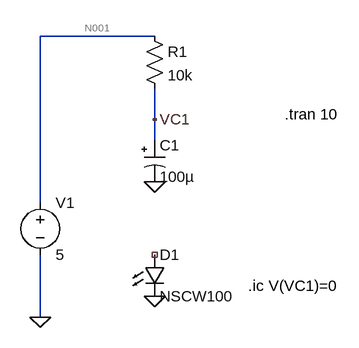
[diagram p0: schematic Project.asc]
Project.asc, the LTspice schematic file:
Version 4
SHEET 1 908 680
WIRE 64 -176 -112 -176
WIRE 64 -48 64 -96
WIRE 64 -16 64 -48
WIRE -112 80 -112 -176
WIRE -112 256 -112 160
FLAG -112 256 0
FLAG 64 -48 VC1
FLAG 64 224 0
FLAG 64 48 0
SYMBOL voltage -112 64 R0
WINDOW 123 0 0 Left 0
WINDOW 39 0 0 Left 0
SYMATTR InstName V1
SYMATTR Value 5
SYMBOL polcap 48 -16 R0
WINDOW 3 24 56 Left 2
SYMATTR InstName C1
SYMATTR Value 100µ
SYMATTR Description Capacitor
SYMATTR Type cap
SYMATTR SpiceLine V=25 Irms=250m Rser=0.6 Lser=0 mfg="Nichicon" pn="UPG1E101MPH" type="Al electrolytic"
SYMBOL res 48 -192 R0
SYMATTR InstName R1
SYMATTR Value 10k
SYMATTR SpiceLine tol=1
SYMBOL LED 48 160 R0
SYMATTR InstName D1
SYMATTR Value NSCW100
TEXT 264 -56 Left 2 !.tran 10
TEXT 208 208 Left 2 !.ic V(VC1)=0

The netlist it stands for:
* Project.asc
V1 N001 0 5
C1 VC1 0 100µ V=25 Irms=250m Rser=0.6 Lser=0 mfg="Nichicon" pn="UPG1E101MPH" type="Al electrolytic"
R1 N001 VC1 10k tol=1
D1 NC_01 0 NSCW100
.model D D
.lib standard.dio
.tran 10
.ic V(VC1)=0
.backanno
.end

* Results of the author's LTspice run, read from the files saved beside the schematic
* Operating Point, zero values left out:
*   V(n001) = 5 V
*   I(R1) = 500 µA
*   I(V1) = -500 µA
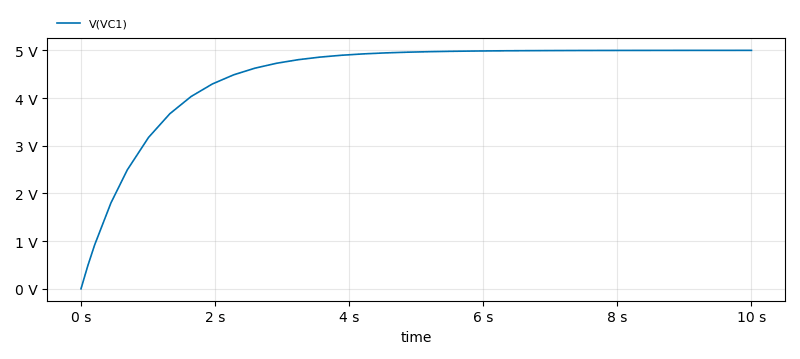
[diagram p1: Transient Analysis of Project.asc, plotted from the saved traces]
* Transient Analysis, 1 run:
*   V(VC1): min 0 V, max 5 V, average 4.497 V, rms 4.609 V, last 5 V